# EAGLE design Shield GRBL V2 (EAGLE 7.7.0)
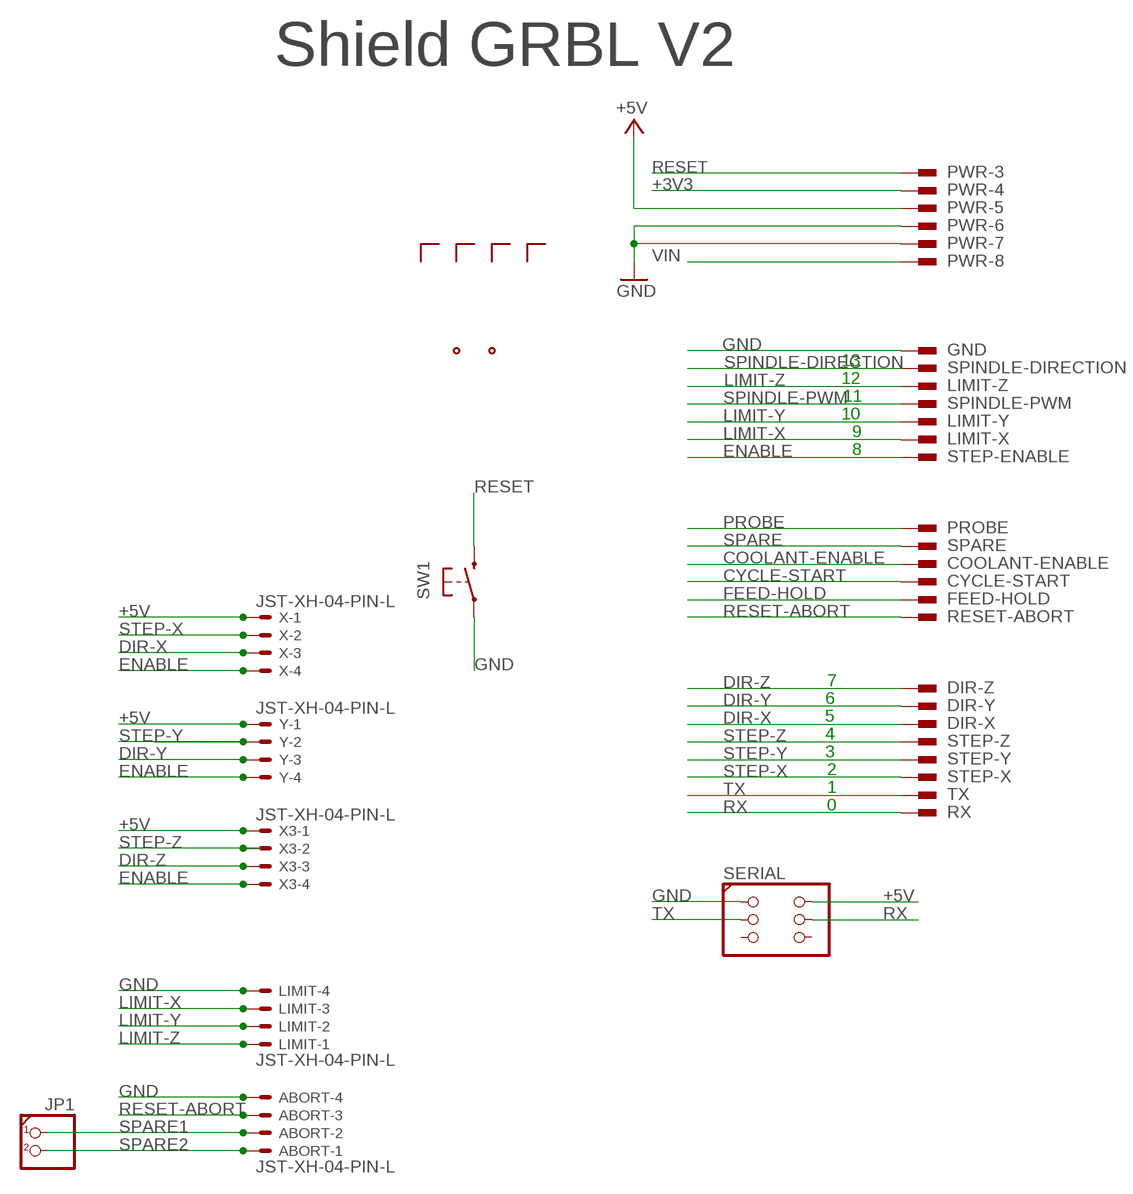
[diagram p0: schematic, sheet 1]

## Parts
ABORT  JST-XH-04-PIN-L  [JST-XH-04-PACKAGE-LONG-PAD]
COOLANT-ENABLE  PINHD-1X1  [1X01]
CYCLE-START  PINHD-1X1  [1X01]
DIR-X  PINHD-1X1  [1X01]
DIR-Y  PINHD-1X1  [1X01]
DIR-Z  PINHD-1X1  [1X01]
FEED-HOLD  PINHD-1X1  [1X01]
GND  PINHD-1X1  [1X01]
JP1  PINHD-1X2  [1X02]
LIMIT  JST-XH-04-PIN-L  [JST-XH-04-PACKAGE-LONG-PAD]
LIMIT-X  PINHD-1X1  [1X01]
LIMIT-Y  PINHD-1X1  [1X01]
LIMIT-Z  PINHD-1X1  [1X01]
PROBE  PINHD-1X1  [1X01]
PWR-3  PINHD-1X1  [1X01]
PWR-4  PINHD-1X1  [1X01]
PWR-5  PINHD-1X1  [1X01]
PWR-6  PINHD-1X1  [1X01]
PWR-7  PINHD-1X1  [1X01]
PWR-8  PINHD-1X1  [1X01]
RESET-ABORT  PINHD-1X1  [1X01]
RX  PINHD-1X1  [1X01]
SERIAL  3x2 M  PINHD-2X3S  [2X03S]
SPARE  PINHD-1X1  [1X01]
SPINDLE-DIRECTION  PINHD-1X1  [1X01]
SPINDLE-PWM  PINHD-1X1  [1X01]
STEP-ENABLE  PINHD-1X1  [1X01]
STEP-X  PINHD-1X1  [1X01]
STEP-Y  PINHD-1X1  [1X01]
STEP-Z  PINHD-1X1  [1X01]
SW1  SWITCH1X2  [SW8X4-SMD]
TX  PINHD-1X1  [1X01]
U$1  MARKERDUAL-60  [MARKER60]
U$2  MARKER  [MARKER]
U$3  MARKER  [MARKER]
U$4  MARKER  [MARKER]
U$5  MARKER  [MARKER]
X  JST-XH-04-PIN-L  [JST-XH-04-PACKAGE-LONG-PAD]
X3  JST-XH-04-PIN-L  [JST-XH-04-PACKAGE-LONG-PAD]
Y  JST-XH-04-PIN-L  [JST-XH-04-PACKAGE-LONG-PAD]

## Nets
+3V3: PWR-4.1
+5V [usbvcc]: PWR-5.1 SERIAL.2 X3.1 X.1 Y.1
COOLANT-ENABLE: COOLANT-ENABLE.1
CYCLE-START: CYCLE-START.1
DIR-X: DIR-X.1 X.3
DIR-Y: DIR-Y.1 Y.3
DIR-Z: DIR-Z.1 X3.3
ENABLE: STEP-ENABLE.1 X3.4 X.4 Y.4
FEED-HOLD: FEED-HOLD.1
GND [gnd]: ABORT.4 GND.1 LIMIT.4 PWR-6.1 PWR-7.1 SERIAL.1 SW1.1(P)
LIMIT-X: LIMIT-X.1 LIMIT.3
LIMIT-Y: LIMIT-Y.1 LIMIT.2
LIMIT-Z: LIMIT-Z.1 LIMIT.1
PROBE: PROBE.1
RESET: PWR-3.1 SW1.2(S)
RESET-ABORT: ABORT.3 RESET-ABORT.1
RX: RX.1 SERIAL.4
SPARE: SPARE.1
SPARE1: ABORT.2 JP1.1
SPARE2: ABORT.1 JP1.2
SPINDLE-DIRECTION: SPINDLE-DIRECTION.1
SPINDLE-PWM: SPINDLE-PWM.1
STEP-X: STEP-X.1 X.2
STEP-Y: STEP-Y.1 Y.2
STEP-Z: STEP-Z.1 X3.2
TX: SERIAL.3 TX.1
VIN [power]: PWR-8.1
Unconnected: SERIAL.5 SERIAL.6

## Notes on the sheet
- Shield GRBL V2
- 13
- 12
- 11
- 10
- 9
- 8
- 7
- 6
- 5
- 4
- 3
- 2
- 1
- 0

## Library data of the parts
ABORT LIMIT X X3 Y = JST XH:JST-XH-04-PIN: JST XH Connector 2 Pin Wire to board connector. Pitch: 2,54 mm, (0.100") Number of pins: 4 Created by Rembrandt Electronics www.rembrandtelectronics.com
COOLANT-ENABLE CYCLE-START DIR-X DIR-Y DIR-Z FEED-HOLD GND LIMIT-X LIMIT-Y LIMIT-Z PROBE PWR-3-PWR-8 RESET-ABORT RX SPARE SPINDLE-DIRECTION SPINDLE-PWM STEP-ENABLE STEP-X STEP-Y STEP-Z TX = MyLib:PINHD-1X1: Connector 1 pin; MF: TYCO ELECTRONICS; MPN: 62221-1; OC_FARNELL: unknown; OC_NEWARK: 16H2318
JP1 = MyLib:PINHD-1X2: PIN HEADER
SERIAL = MyLib:PINHD-2X3
SW1 = MyLib:SWITCH1X2
U$1 = MyLib:MARKERDUAL: Marker for Duallayer boards
U$2-U$5 = MyLib:MARKER: Marker pad without connections

## Net classes
0 default: width 0.254 mm, clearance 0.254 mm
1 power: width 0.61 mm, drill 0.61 mm, clearance 0.254 mm
2 gnd: width 0.305 mm, drill 0.559 mm, clearance 0.254 mm
3 usbvcc: width 0.508 mm, drill 0.61 mm, clearance 0.254 mm
4 aref: width 0.406 mm, drill 0.61 mm, clearance 0.254 mm

## Board
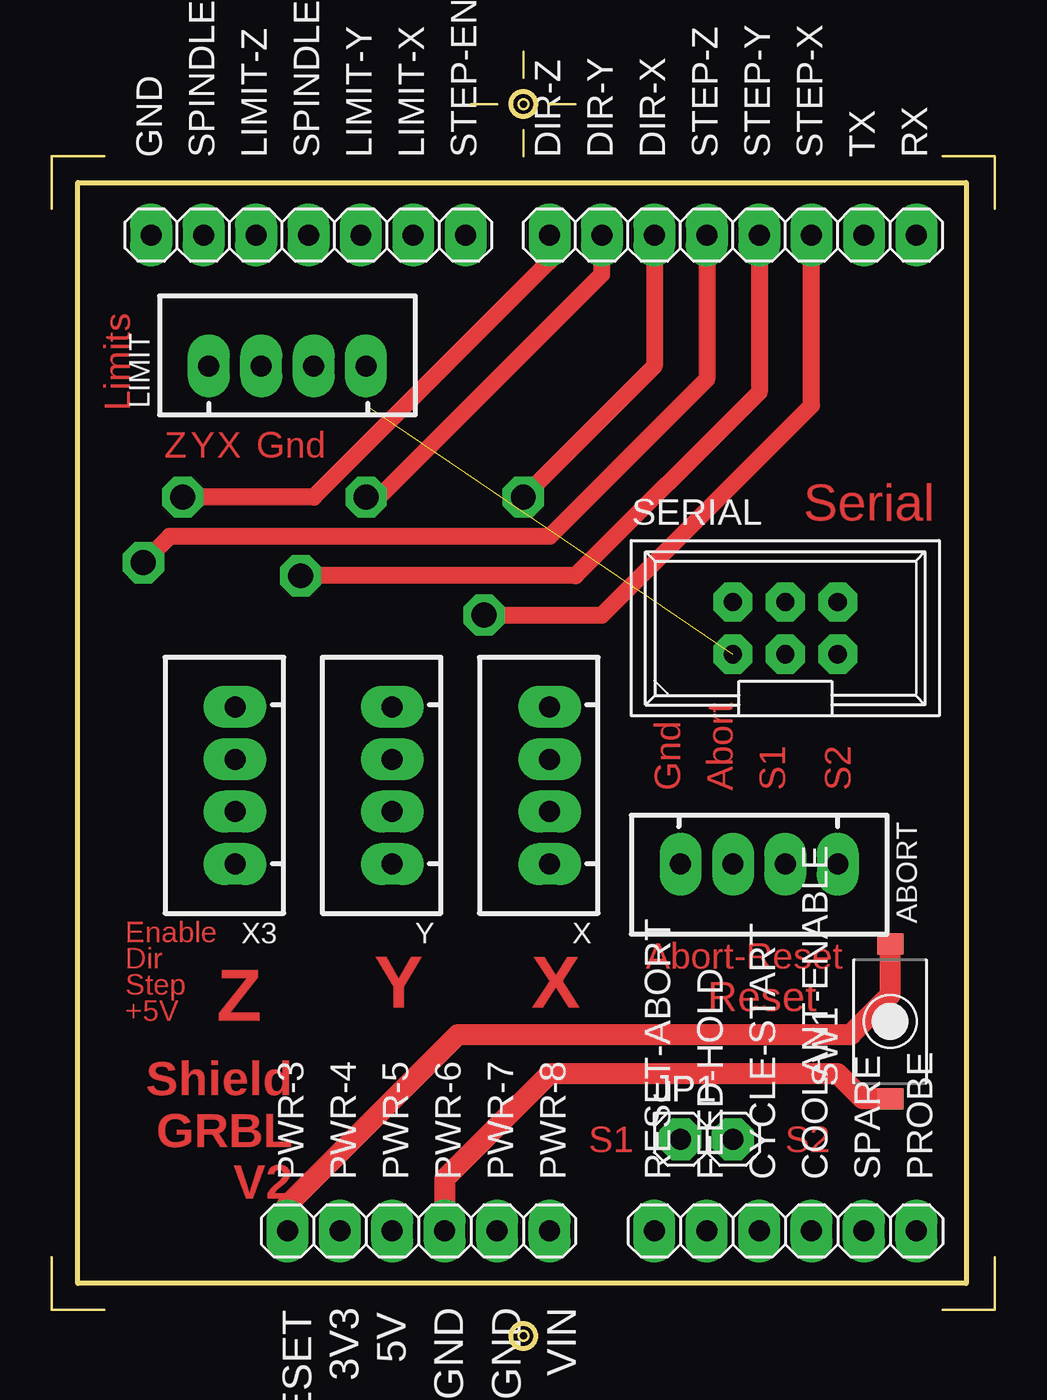
[diagram p1: board, top side]
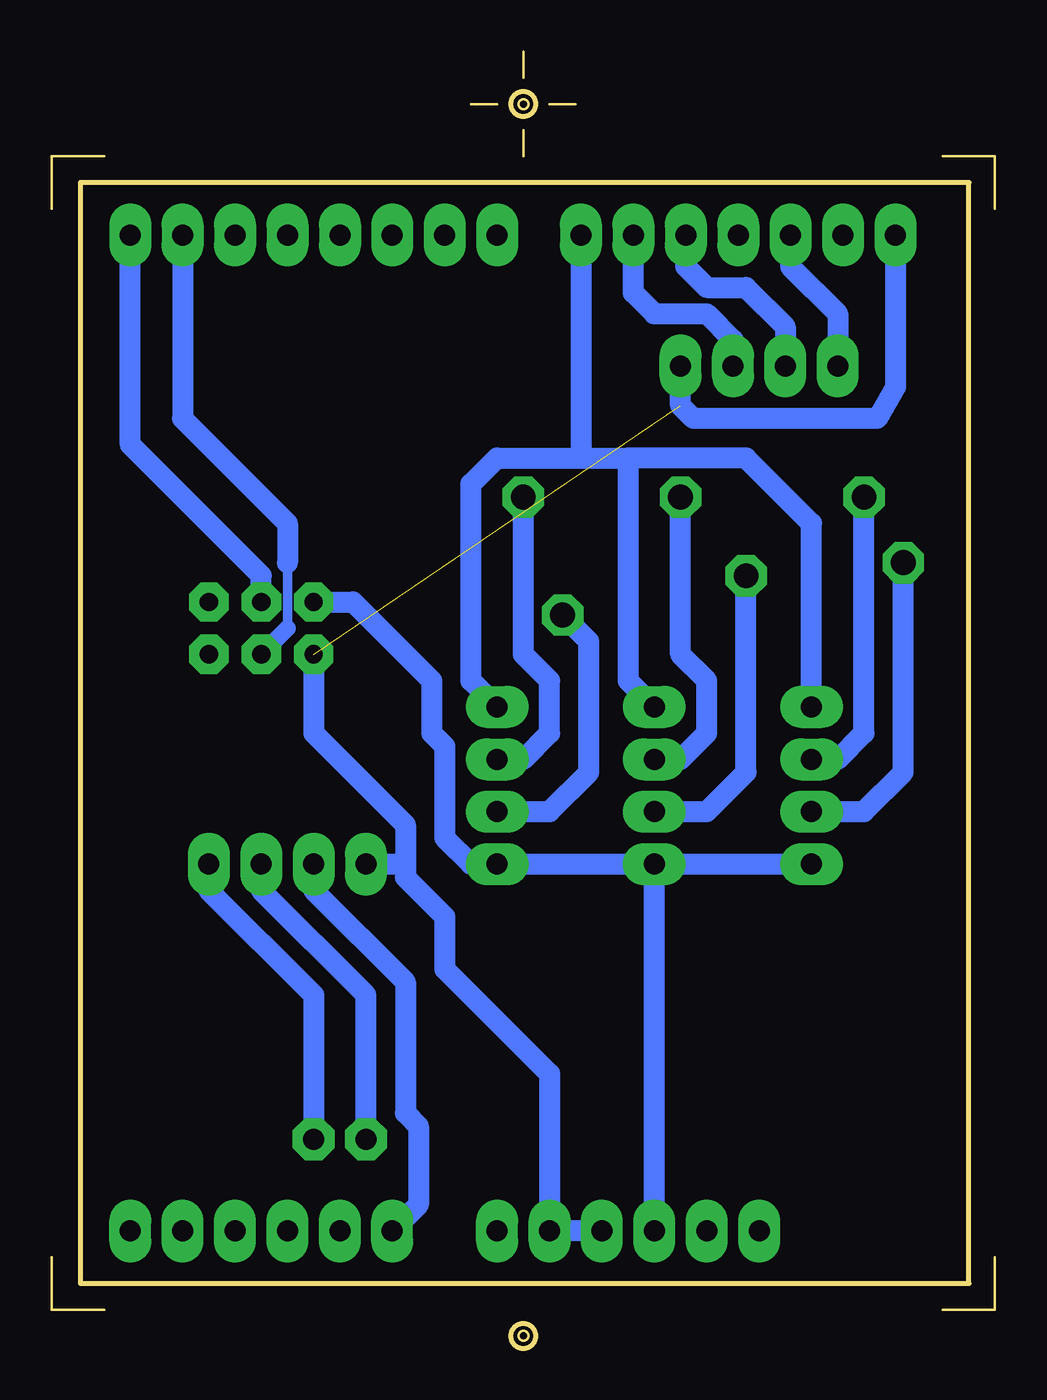
[diagram p2: board, bottom side, seen from below]

Size 43.05 x 53.34 mm. Coordinates in mm from the lower left corner, seen from the top.
Outline: 43.05,0 0,0 0,53.34 43.05,53.34 43.05,0
Copper layers (1*16): Top 0.035mm / dielectric 1.5mm / Bottom 0.035mm
Design rules "default *": minimum track width 10mil, minimum drill 22mil, track to track 10mil, track to pad 10mil, pad to pad 10mil, via to via 12mil, smd to smd 8mil, copper to edge 26mil, drill to drill 12mil, minimum pad ring 20mil, minimum via ring 10mil, stop-mask expansion 1mil, vias tented up to drill 30mil, thermal gap 10mil

### Footprints (pad centres in the part's own frame; a part is rotated, then mirrored left to right if it is on the bottom)
JST-XH-04-PACKAGE-LONG-PAD = drill 1.016 long: 1 -3.81,0; 2 -1.27,0; 3 1.27,0; 4 3.81,0
1X01 = drill 1.016 long: 1 0,0
1X02 = drill 1.016 octagon: 1 -2.54,0; 2 0,0
2X03S = drill 0.889 pad 1.676 octagon: 1 -2.54,-1.27; 2 -2.54,1.27; 3 0,-1.27; 4 0,1.27; 5 2.54,-1.27; 6 2.54,1.27
SW8X4-SMD = smd 1.27 x 1.016: 1 0,-3.75; 2 0,3.75

### Placement (x,y rotation side)
ABORT  33.02,20.32 180 top
COOLANT-ENABLE  35.56,2.54 0 top
CYCLE-START  33.02,2.54 0 top
DIR-X  27.94,50.8 180 top
DIR-Y  25.4,50.8 180 top
DIR-Z  22.86,50.8 180 top
FEED-HOLD  30.48,2.54 0 top
GND  3.56,50.8 180 top
JP1  31.75,6.99 0 top
LIMIT  10.16,44.45 0 top
LIMIT-X  16.26,50.8 180 top
LIMIT-Y  13.72,50.8 180 top
LIMIT-Z  8.64,50.8 180 top
PROBE  40.64,2.54 0 top
PWR-3  10.16,2.54 0 top
PWR-4  12.7,2.54 0 top
PWR-5  15.24,2.54 0 top
PWR-6  17.78,2.54 0 top
PWR-7  20.32,2.54 0 top
PWR-8  22.86,2.54 0 top
RESET-ABORT  27.94,2.54 0 top
RX  40.64,50.8 180 top
SERIAL  34.29,31.75 0 top
SPARE  38.1,2.54 0 top
SPINDLE-DIRECTION  6.1,50.8 180 top
SPINDLE-PWM  11.18,50.8 180 top
STEP-ENABLE  18.8,50.8 180 top
STEP-X  35.56,50.8 180 top
STEP-Y  33.02,50.8 180 top
STEP-Z  30.48,50.8 180 top
SW1  39.37,12.7 0 top
TX  38.1,50.8 180 top
U$1  21.59,57.15 270 bottom  (outside the outline)
U$2  -1.27,54.61 0 top
U$3  -1.27,-1.27 90 top
U$4  44.45,-1.27 180 top
U$5  44.45,54.61 270 top
X  22.86,24.13 90 top
X3  7.62,24.13 90 top
Y  15.24,24.13 90 top

### Tracks (layer width: path | path; a pad name or v marks a point on that pad's centre or on a via)
+5V
  Bottom 1.016: SERIAL.2 29.84,33.02 26.04,29.21 26.04,26.67 25.4,26.04 25.4,21.59 24.13,20.32 X.1 Y.1 | Y.1 X3.1 | PWR-5.1 Y.1
DIR-X  (via drill 1.2 pad 2)
  Top 0.813: DIR-X.1 27.94,44.45 v21.59,38.1
  Bottom 0.61: v21.59,38.1 21.7,38.22
  Bottom 1.016: X.3 21.59,25.4 20.32,26.67 20.32,29.21 21.59,30.48 v21.59,38.1
DIR-Y  (via drill 1.2 pad 2)
  Top 0.813: DIR-Y.1 25.4,48.9 14.61,38.1 v13.97,38.1
  Bottom 1.016: 14.09,38.22 v13.97,38.1 13.97,30.48 12.7,29.21 12.7,26.67 13.97,25.4 Y.3
DIR-Z  (via drill 1.2 pad 2)
  Top 0.813: DIR-Z.1 22.86,49.53 11.43,38.1 v5.08,38.1
  Bottom 1.016: 5.2,38.22 v5.08,38.1 5.08,26.67 6.35,25.4 X3.3
ENABLE
  Bottom 0.61: 18.8,40.26 18.41,40.01
  Bottom 1.016: X3.4 7.62,36.83 10.79,40.01 16.51,40.01 | 16.51,40.01 16.51,29.21 Y.4 | 16.51,40.01 18.41,40.01 22.86,40.01 24.13,38.73 24.13,29.21 X.4 | STEP-ENABLE.1 18.8,40.26
GND  (1 unrouted)
  Top 1.016: SW1.1 38.04,8.95 36.83,10.16 22.86,10.16 17.78,5.08 PWR-6.1
  Bottom 1.016: 27.3,20.32 27.3,22.23 31.75,26.67 SERIAL.1 | 27.3,20.32 27.3,19.68 25.4,17.78 25.4,15.24 20.32,10.16 PWR-7.1 PWR-6.1 | GND.1 3.56,43.43 4.45,41.91 13.34,41.91 13.97,42.55 LIMIT.4 | ABORT.4 27.3,20.32
LIMIT-X
  Bottom 1.016: LIMIT-X.1 16.26,48.01 15.24,46.99 12.7,46.99 11.43,45.72 LIMIT.3
LIMIT-Y
  Bottom 1.016: LIMIT-Y.1 13.72,49.28 12.7,48.26 10.79,48.26 8.89,46.35 LIMIT.2
LIMIT-Z
  Bottom 1.016: LIMIT-Z.1 8.64,49.28 6.35,46.99 LIMIT.1
RESET
  Top 1.016: PWR-3.1 10.16,3.81 18.41,12.06 37.47,12.06 39.37,13.97 SW1.2
RESET-ABORT
  Bottom 1.016: RESET-ABORT.1 26.67,3.81 26.67,7.62 27.3,8.26 27.3,14.61 31.75,19.05 ABORT.3
RX
  Bottom 1.016: SERIAL.4 34.29,34.29 40.64,40.64 RX.1
SPARE1
  Bottom 1.016: JP1.1 29.21,13.97 34.29,19.05 ABORT.2
SPARE2
  Bottom 1.016: JP1.2 31.75,13.97 36.83,19.05 ABORT.1
STEP-X  (via drill 1.2 pad 2)
  Top 0.813: v19.68,32.38 25.4,32.38 35.56,42.55 STEP-X.1
  Bottom 1.016: X.2 20.32,22.86 18.41,24.77 18.41,31.11 v19.68,32.38
STEP-Y  (via drill 1.2 pad 2)
  Top 0.813: STEP-Y.1 33.02,43.18 24.13,34.29 v10.79,34.29
  Bottom 1.016: Y.2 12.7,22.86 10.79,24.77 v10.79,34.29
STEP-Z  (via drill 1.2 pad 2)
  Top 0.813: STEP-Z.1 30.48,43.81 22.86,36.2 4.45,36.2 v3.17,34.92
  Bottom 1.016: X3.2 5.08,22.86 3.17,24.77 v3.17,34.92
TX
  Bottom 0.457: 33.02,34.92 33.02,31.75
  Bottom 0.813: 33.02,31.75 SERIAL.3
  Bottom 1.016: TX.1 38.1,41.91 33.02,36.83 33.02,34.92

### Text on the board
Top: Limits | Z | Y | X | Gnd | Serial | Gnd | Abort | S1 | S2 | Enable | Abort-Reset | Dir | Reset | Step | +5V | Z | Y | X | Shield / GRBL / V2 | S1 | S2
tNames: RESET | 3V3 | 5V | GND | GND | VIN
214bmp: D:/SmartProjects/Snc/a4_bn_logo2.bmp